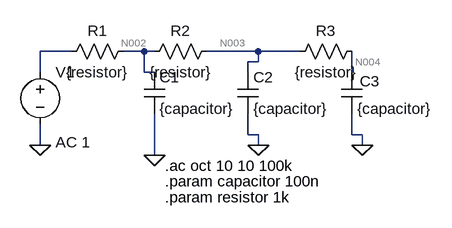
[diagram p0: schematic L3.asc]
L3.asc, the LTspice schematic file:
Version 4
SHEET 1 880 680
WIRE 128 96 80 96
WIRE 240 96 208 96
WIRE 256 96 240 96
WIRE 416 96 336 96
WIRE 480 96 416 96
WIRE 416 112 416 96
WIRE 416 112 400 112
WIRE 80 128 80 96
WIRE 240 128 240 96
WIRE 256 128 240 128
WIRE 400 128 400 112
WIRE 560 128 560 96
WIRE 400 224 400 192
WIRE 416 224 400 224
WIRE 560 224 560 192
WIRE 576 224 560 224
WIRE 80 240 80 208
WIRE 416 240 416 224
WIRE 576 240 576 224
WIRE 256 256 256 192
FLAG 80 240 0
FLAG 256 256 0
FLAG 416 240 0
FLAG 576 240 0
SYMBOL voltage 80 112 R0
WINDOW 123 24 124 Left 2
WINDOW 39 0 0 Left 0
SYMATTR InstName V1
SYMATTR Value ""
SYMATTR Value2 AC 1
SYMBOL cap 240 128 R0
SYMATTR InstName C1
SYMATTR Value {capacitor}
SYMBOL cap 384 128 R0
SYMATTR InstName C2
SYMATTR Value {capacitor}
SYMBOL cap 544 128 R0
WINDOW 0 28 14 Left 2
SYMATTR InstName C3
SYMATTR Value {capacitor}
SYMBOL res 224 80 R90
WINDOW 0 0 56 VBottom 2
WINDOW 3 32 56 VTop 2
SYMATTR InstName R1
SYMATTR Value {resistor}
SYMBOL res 352 80 R90
WINDOW 0 0 56 VBottom 2
WINDOW 3 32 56 VTop 2
SYMATTR InstName R2
SYMATTR Value {resistor}
SYMBOL res 576 80 R90
WINDOW 0 0 56 VBottom 2
WINDOW 3 32 56 VTop 2
SYMATTR InstName R3
SYMATTR Value {resistor}
TEXT 272 320 Left 2 !.param resistor 1k
TEXT 272 296 Left 2 !.param capacitor 100n
TEXT 272 272 Left 2 !.ac oct 10 10 100k

The netlist it stands for:
* L3.asc
V1 N001 0 AC 1
C1 N002 0 {capacitor}
C2 N003 0 {capacitor}
C3 N004 0 {capacitor}
R1 N002 N001 {resistor}
R2 N003 N002 {resistor}
R3 N004 N003 {resistor}
.param resistor 1k
.param capacitor 100n
.ac oct 10 10 100k
.backanno
.end

* Results of the author's LTspice run, read from the files saved beside the schematic
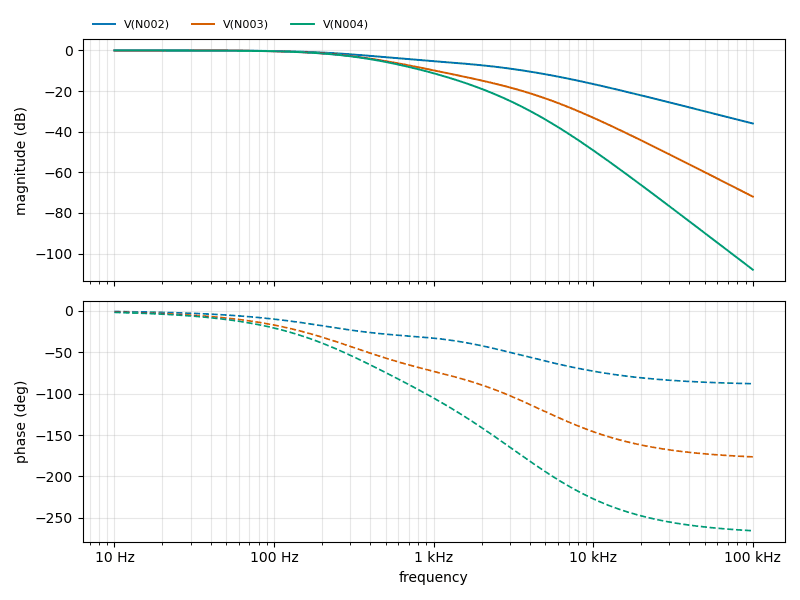
[diagram p1: AC Analysis of L3.asc, plotted from the saved traces]
* AC Analysis, 1 run:
*   V(N002): -0.00 dB at 10 Hz, -35.97 dB at 100 kHz, peak -0.00 dB at 10 Hz, 3 dB below the peak at 444.2 Hz
*   V(N003): -0.00 dB at 10 Hz, -71.94 dB at 100 kHz, peak -0.00 dB at 10 Hz, 3 dB below the peak at 321.6 Hz
*   V(N004): -0.00 dB at 10 Hz, -107.91 dB at 100 kHz, peak -0.00 dB at 10 Hz, 3 dB below the peak at 309.3 Hz